# EasyEDA schematic CNC head.json
TITLE: Sheet_1; REV: 1.0; Date: 2024-11-28; Sheet: 1/1; Company: Your Company
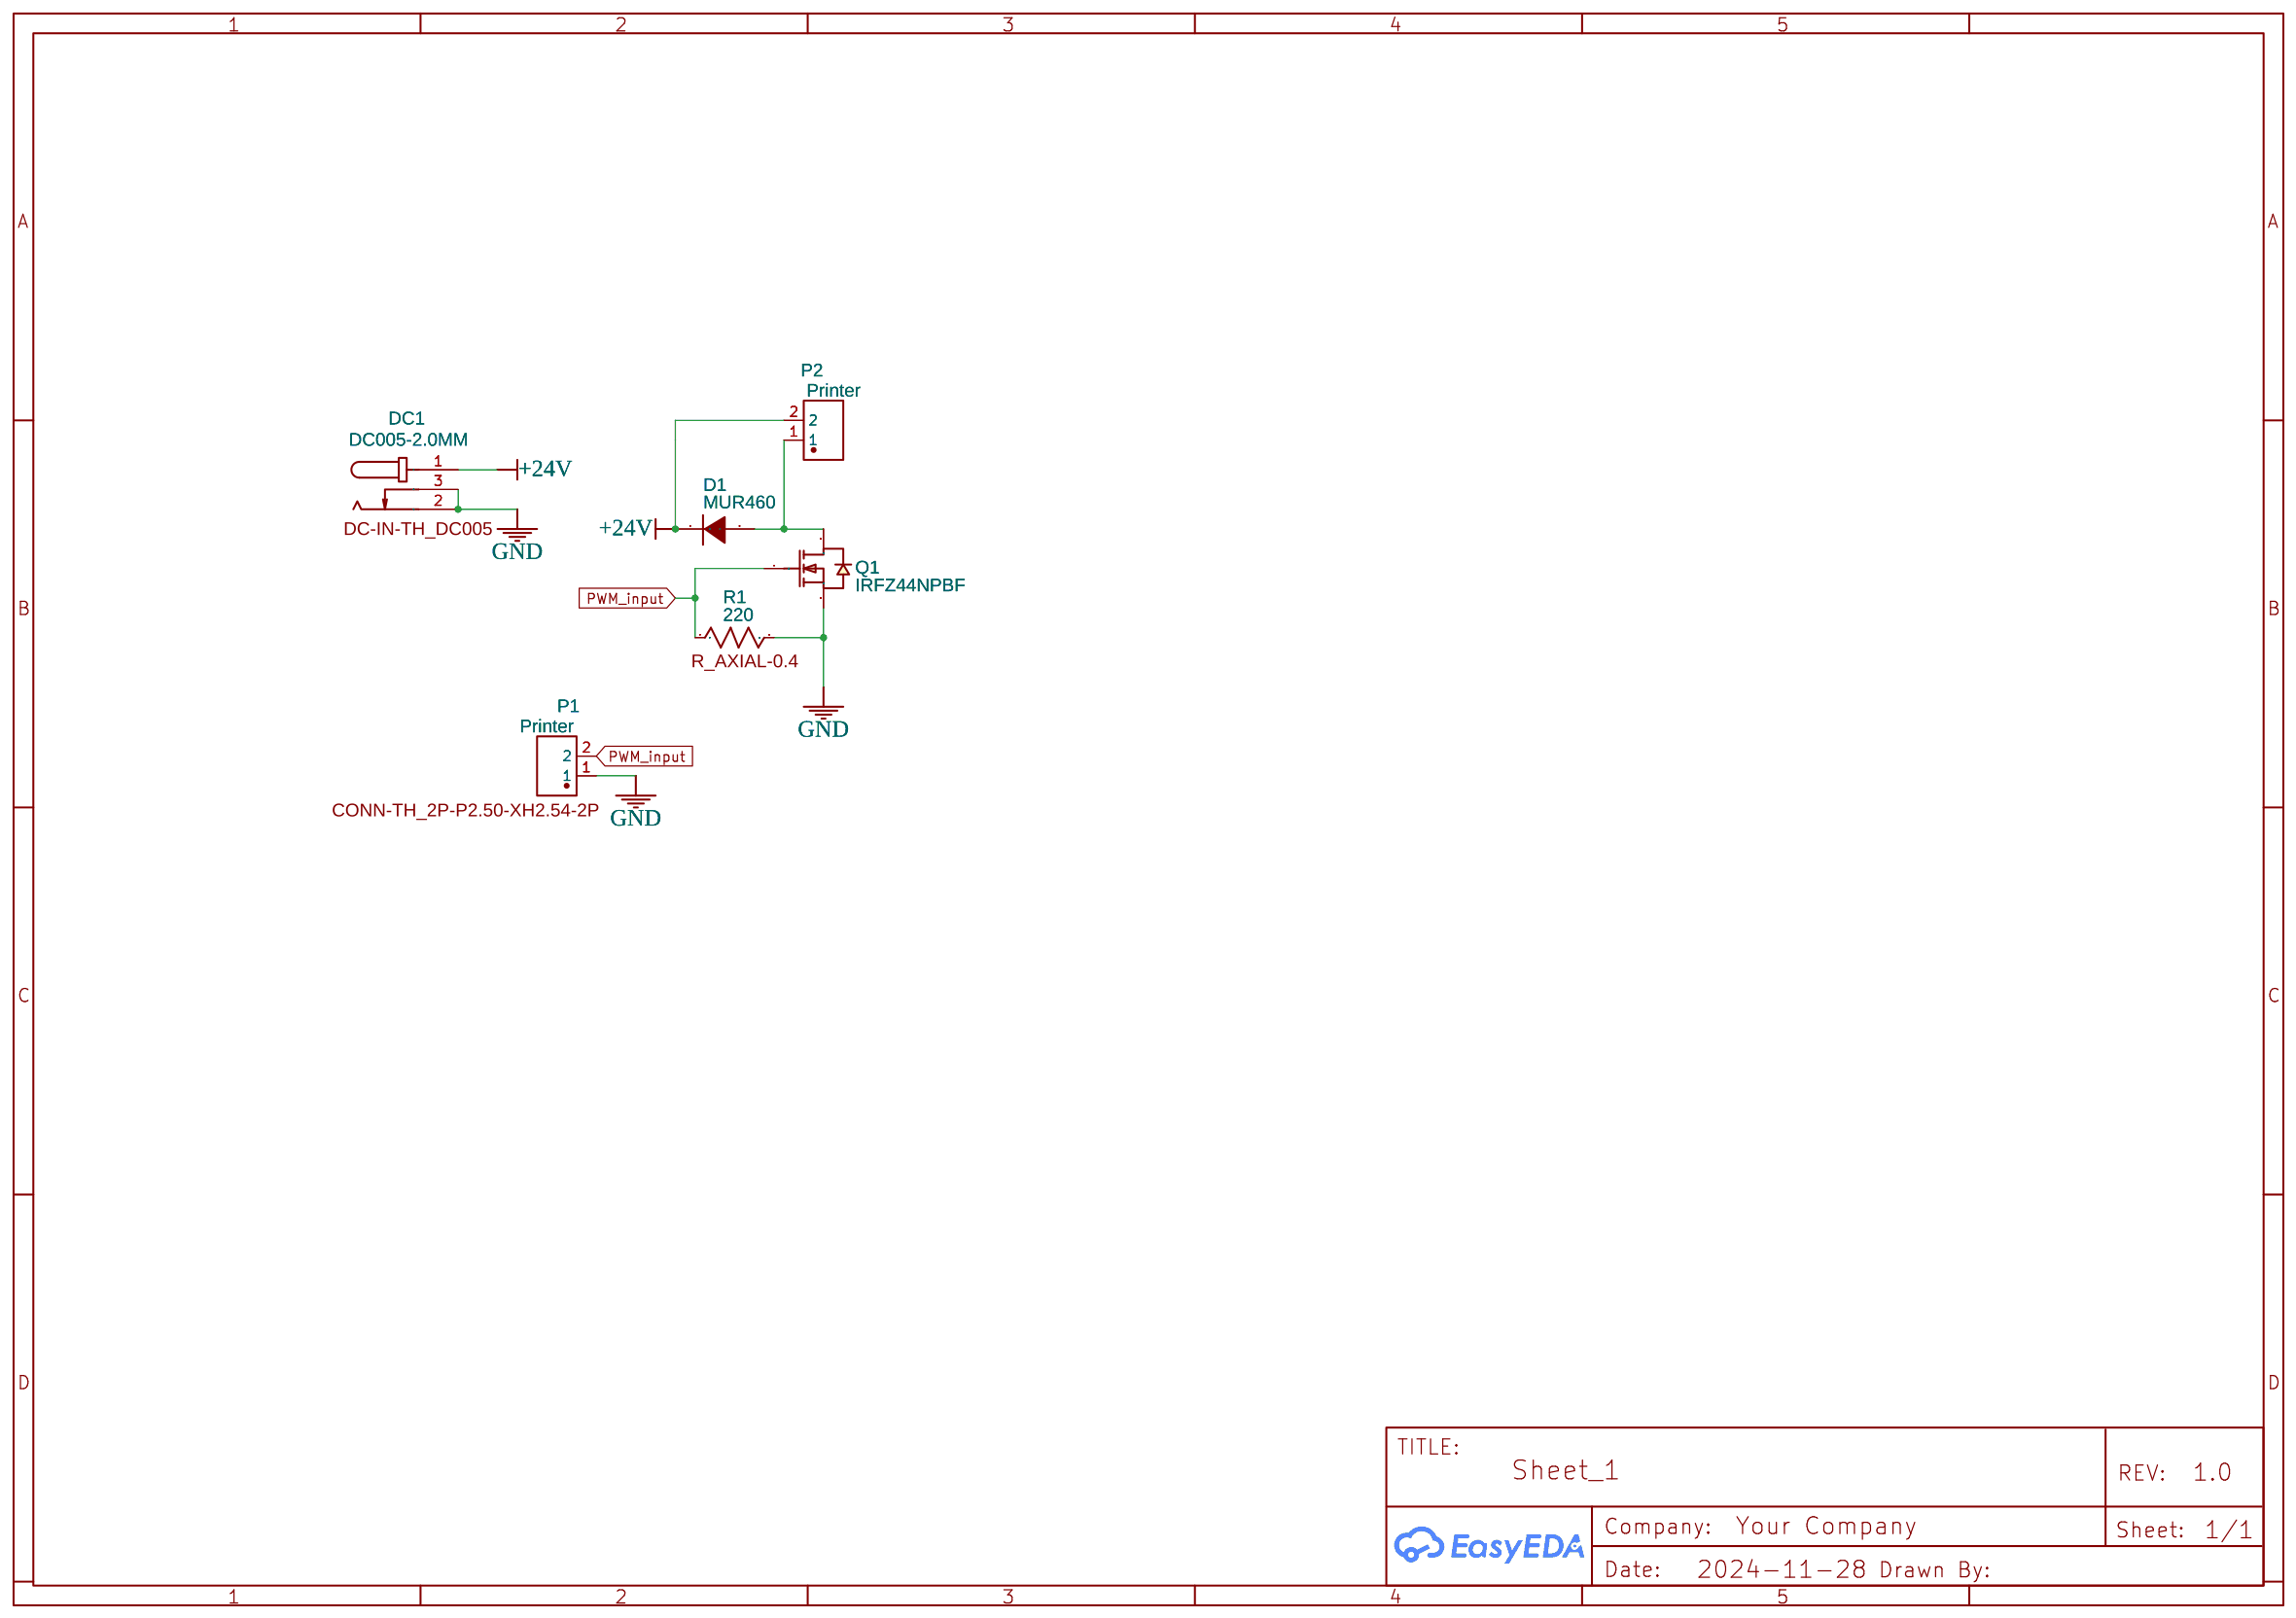
[diagram p0: schematic sheet]

## Parts
D1  MUR460  [MUR460]
DC1  DC005-2.0MM  [DC-IN-TH_DC005]
P1  Printer  [CONN-TH_2P-P2.50-XH2.54-2P]
P2  Printer  [CONN-TH_2P-P2.50-XH2.54-2P]
Q1  IRFZ44NPBF  [TO-220-3_L10.0-W4.5-P2.54-L]
R1  220  [R_AXIAL-0.4]

## Library data of the parts
D1 = MUR460: Supplier: LCSC; Supplier Part: C241909; Manufacturer: Vishay Intertech; Manufacturer Part: MUR460-E3/73; Contributor: LCSC; JLCPCB Part Class: Extended Part; Package Display: No
DC1 = DC005-2.0MM: Supplier: LCSC; Manufacturer: SOFNG; Supplier Part: C111567; Package Display: Yes
P1 = XH-2P-2.54: Contributor: LCSC; Convert to PCB: Yes; Add into BOM: Yes; Supplier: LCSC; Supplier Part: C9900003929; Manufacturer: null; Package Display: Yes
P2 = XH-2P-2.54: Contributor: LCSC; Convert to PCB: Yes; Add into BOM: Yes; Supplier: LCSC; Supplier Part: C9900003929; Manufacturer: null; Package Display: No
Q1 = IRFZ44NPBF: Supplier: LCSC; Manufacturer: Infineon(英飞凌); Supplier Part: C2586; JLCPCB Part Class: Extended Part; Package Display: No
R1 = R_AXIAL-0.4_US: Contributor: LCEDA_Lib; Package Display: Yes

## Nets
+24V: D1.1(K) DC1.1 P2.2
GND: DC1.2 DC1.3 P1.1 Q1.3(S) R1.2
PWM_input: P1.2 Q1.1(G) R1.1
Net-(D1-2): D1.2(A) P2.1 Q1.2(D)
